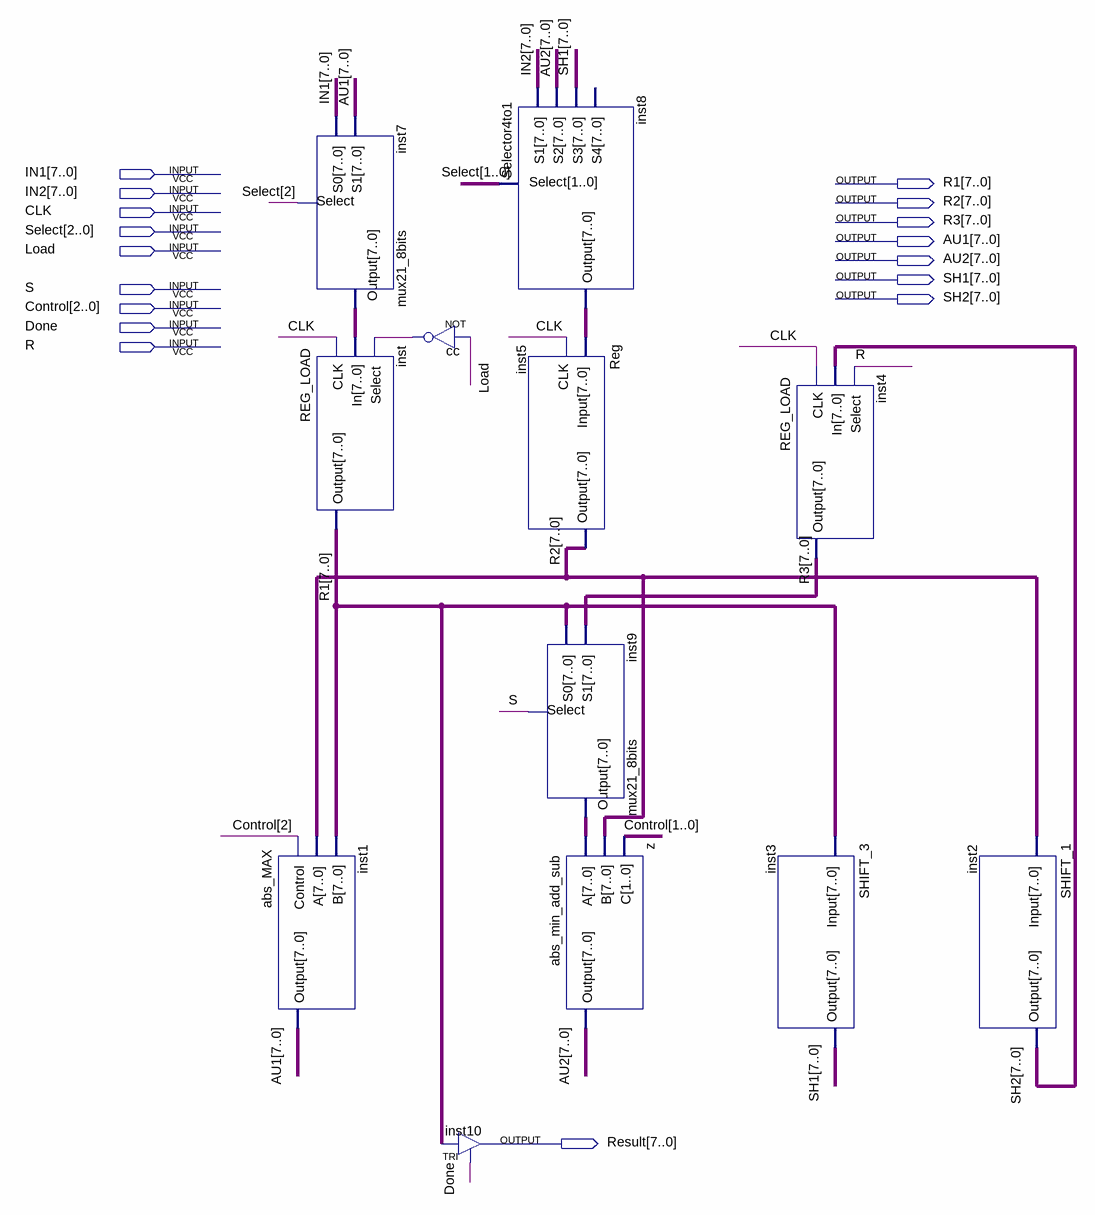
[diagram p0: schematic sheet]
// Quartus schematic Datapath_version3.bdf as structural Verilog: 12 symbols, 17 pins
module Datapath_version3 (
  input  [7:0] IN1,
  input  [7:0] IN2,
  input  CLK,
  input  [2:0] Select,
  input  Load,
  input  S,
  input  [2:0] Control,
  input  Done,
  input  R,
  output [7:0] R1,
  output [7:0] R2,
  output [7:0] R3,
  output [7:0] AU1,
  output [7:0] AU2,
  output [7:0] SH1,
  output [7:0] SH2,
  output [7:0] Result
);

  wire cc_out;
  wire [7:0] inst7_output, inst8_output, inst9_output;

  abs_MAX inst1 (.Control(Control[2]), .A(R2), .B(R1), .Output(AU1));
  mux21_8bits inst7 (.S0(IN1), .S1(AU1), .Select(Select[2]), .Output(inst7_output));
  REG_LOAD inst (.CLK(CLK), .In(inst7_output), .Select(cc_out), .Output(R1));
  not cc (cc_out, Load);
  TRI inst10[7:0] (.IN(R1), .OE(Done), .OUT(Result));
  Selector4to1 inst8 (.S1(IN2), .S2(AU2), .S3(SH1), .Select(Select[1:0]), .Output(inst8_output));  // open: S4
  Reg inst5 (.Input(inst8_output), .CLK(CLK), .Output(R2));
  mux21_8bits inst9 (.S0(R1), .S1(R3), .Select(S), .Output(inst9_output));
  abs_min_add_sub z (.A(inst9_output), .B(R2), .C(Control[1:0]), .Output(AU2));
  REG_LOAD inst4 (.CLK(CLK), .In(SH2), .Select(R), .Output(R3));
  SHIFT_3 inst3 (.Input(R1), .Output(SH1));
  SHIFT_1 inst2 (.Input(R2), .Output(SH2));
endmodule
